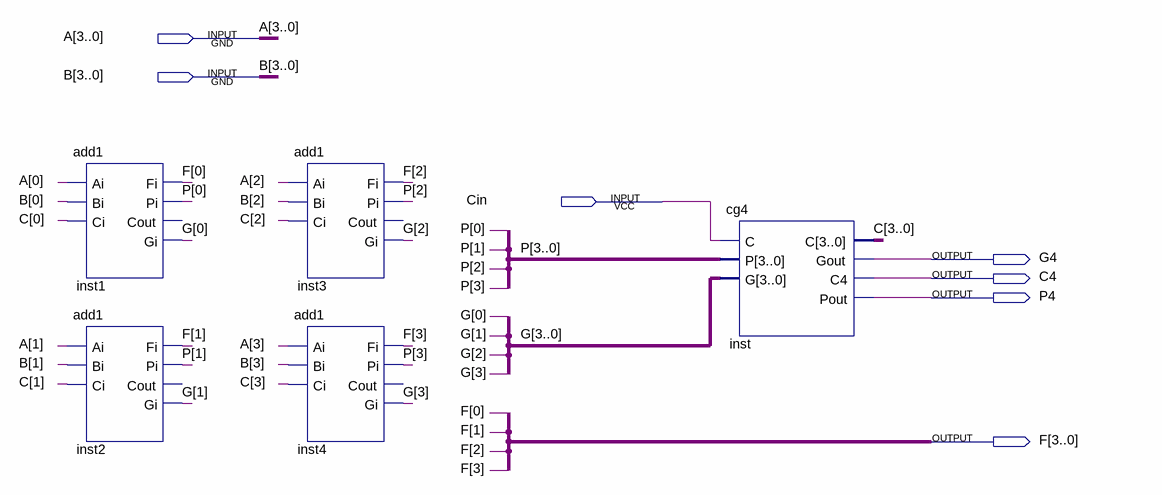
[diagram p0: schematic sheet]
// Quartus schematic add4.bdf as structural Verilog: 5 symbols, 7 pins
module add4 (
  input  [3:0] A,
  input  [3:0] B,
  input  Cin,
  output G4,
  output C4,
  output P4,
  output [3:0] F
);

  wire [3:0] C, G, P;

  add1 inst1 (.Ai(A[0]), .Bi(B[0]), .Ci(C[0]), .Fi(F[0]), .Pi(P[0]), .Gi(G[0]));  // open: Cout
  add1 inst2 (.Ai(A[1]), .Bi(B[1]), .Ci(C[1]), .Fi(F[1]), .Pi(P[1]), .Gi(G[1]));  // open: Cout
  add1 inst3 (.Ai(A[2]), .Bi(B[2]), .Ci(C[2]), .Fi(F[2]), .Pi(P[2]), .Gi(G[2]));  // open: Cout
  add1 inst4 (.Ai(A[3]), .Bi(B[3]), .Ci(C[3]), .Fi(F[3]), .Pi(P[3]), .Gi(G[3]));  // open: Cout
  cg4 inst (.C({C[3:1], Cin, C[0]}), .P(P), .G(G), .Gout(G4), .C4(C4), .Pout(P4));
endmodule
